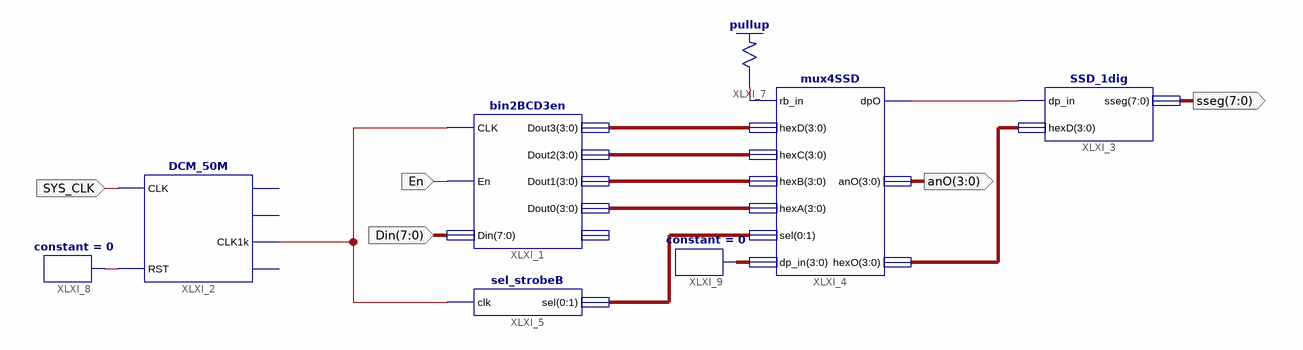
[diagram p0: schematic sheet 1]
// Xilinx ISE schematic Lab6_Ex3.sch (spartan3e) as structural Verilog: 8 symbols, 5 ports
module Lab6_Ex3 (
  input  SYS_CLK,
  input  [7:0] Din,
  input  En,
  output [7:0] sseg,
  output [3:0] anO
);

  wire XLXN_32, XLXN_38, XLXN_44, XLXN_45;
  wire [1:0] XLXN_21;
  wire [3:0] XLXN_12, XLXN_13, XLXN_14, XLXN_15, XLXN_37, XLXN_46;

  bin2BCD3en XLXI_1 (
    .CLK(XLXN_32), .En(En), .Din(Din), .Dout3(XLXN_12), .Dout2(XLXN_13), .Dout1(XLXN_14), .Dout0(XLXN_15));  // open: RBout
  DCM_50M XLXI_2 (.CLK(SYS_CLK), .RST(XLXN_45), .CLK1k(XLXN_32));  // open: CLK1M, CLK10k, CLK1
  mux4SSD XLXI_4 (
    .rb_in(XLXN_44), .hexD(XLXN_12), .hexC(XLXN_13), .hexB(XLXN_14), .hexA(XLXN_15),
    .sel({XLXN_21[0], XLXN_21[1]}), .dp_in(XLXN_46), .dpO(XLXN_38), .anO(anO), .hexO(XLXN_37));
  sel_strobeB XLXI_5 (.clk(XLXN_32), .sel({XLXN_21[0], XLXN_21[1]}));
  SSD_1dig XLXI_3 (.dp_in(XLXN_38), .hexD(XLXN_37), .sseg(sseg));
  \pullup  XLXI_7 (.O(XLXN_44));
  constant #(.CValue("0")) XLXI_8 (.O(XLXN_45));
  constant #(.CValue("0")) XLXI_9 (.O(XLXN_46));
endmodule
